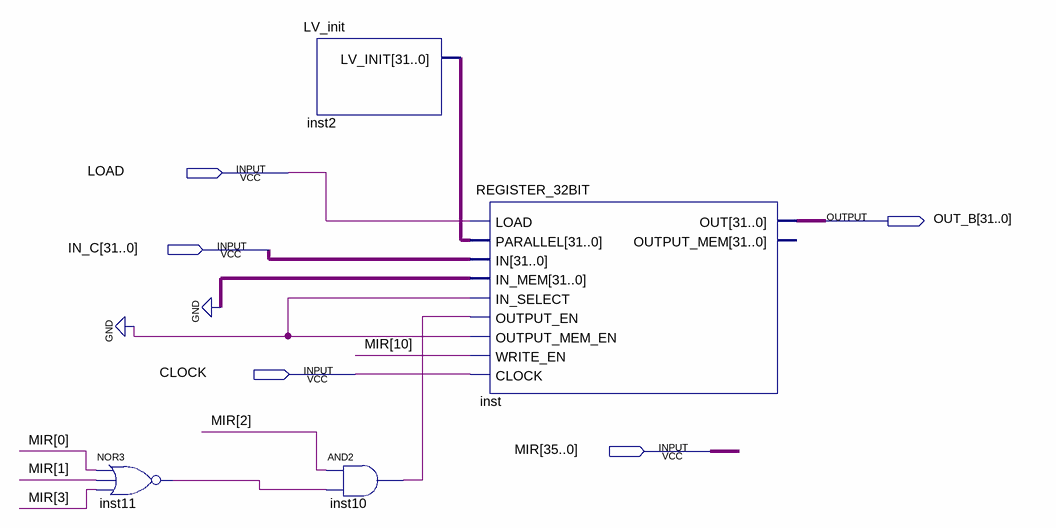
[diagram p0: schematic sheet]
// Quartus schematic SP.bdf as structural Verilog: 4 symbols, 5 pins
module SP (
  input  LOAD,
  input  [31:0] IN_C,
  input  CLOCK,
  input  [35:0] MIR,
  output [31:0] OUT_B
);

  wire inst10_out, inst11_out;
  wire [31:0] inst2_lv_init;

  nor inst11 (inst11_out, MIR[0], MIR[1], MIR[3]);
  LV_init inst2 (.LV_INIT(inst2_lv_init));
  and inst10 (inst10_out, MIR[2], inst11_out);
  REGISTER_32BIT inst (
    .LOAD(LOAD), .PARALLEL(inst2_lv_init), .IN(IN_C), .IN_MEM({32{1'b0}}), .IN_SELECT(1'b0),
    .OUTPUT_EN(inst10_out), .OUTPUT_MEM_EN(1'b0), .WRITE_EN(MIR[10]), .CLOCK(CLOCK), .OUT(OUT_B));  // open: OUTPUT_MEM
endmodule
